# EAGLE design ACBoard (EAGLE 5.10)
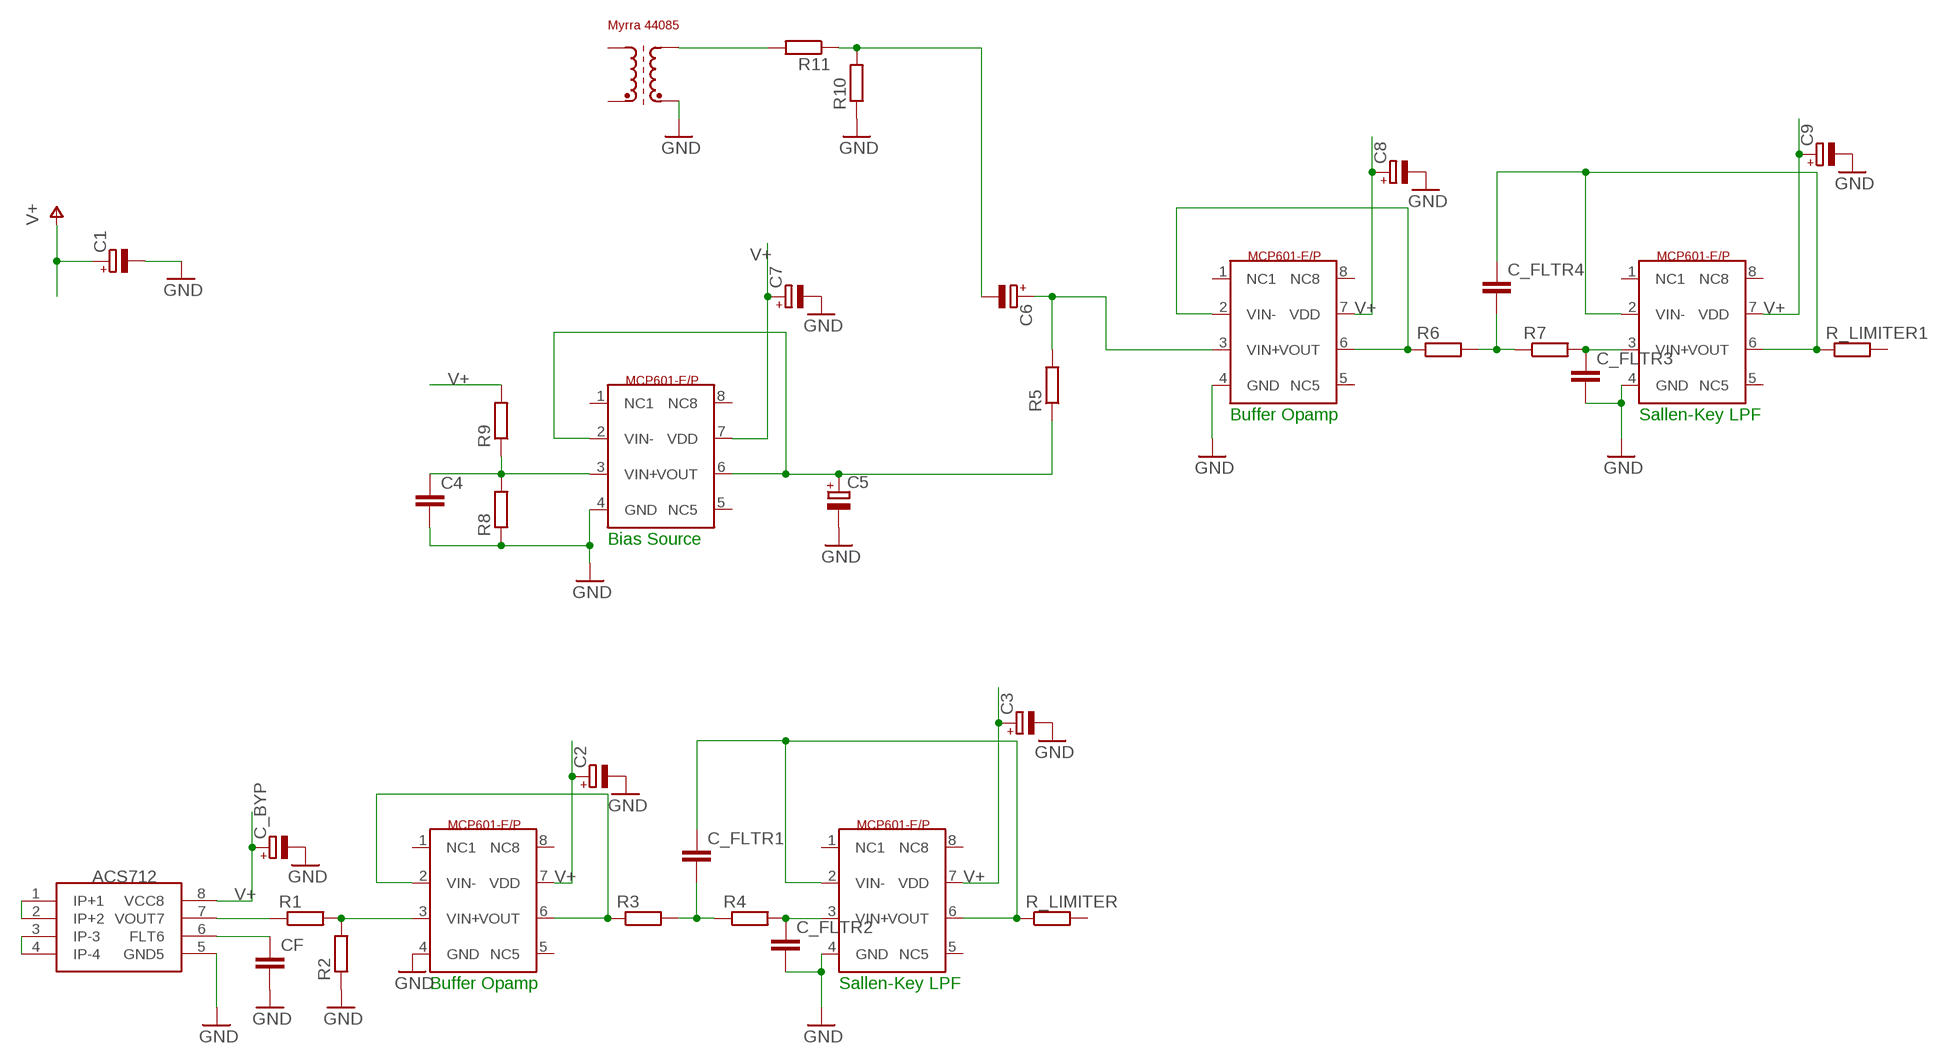
[diagram p0: schematic, sheet 1]

## Parts
BIAS  MCP601  [PDIP8]
C1  CPOL1  [E2,5-7---100UF]
C2  CPOL1  [E2,5-7---100UF]
C3  CPOL1  [E2,5-7---100UF]
C4  C5P  [C050-030-075]
C5  CPOL1  [E2,5-7---100UF]
C6  CPOL1  [E2,5-7---100UF]
C7  CPOL1  [E2,5-7---100UF]
C8  CPOL1  [E2,5-7---100UF]
C9  CPOL1  [E2,5-7---100UF]
C_BYP  CPOL1  [E2,5-7---100UF]
C_FLTR1  C5P  [C050-030-075]
C_FLTR2  C5P  [C050-030-075]
C_FLTR3  C5P  [C050-030-075]
C_FLTR4  C5P  [C050-030-075]
CF  C5P  [C050-030-075]
R1  R  [0207/10]
R2  R  [0207/10]
R3  R  [0207/10]
R4  R  [0207/10]
R5  R  [0207/10]
R6  R  [0207/10]
R7  R  [0207/10]
R8  R  [0207/10]
R9  R  [0207/10]
R10  R  [0207/10]
R11  R  [0207/10]
R_LIMITER  R  [0207/10]
R_LIMITER1  R  [0207/10]
U$1  ACS712  [SOIC8]
U$2  MCP601  [PDIP8]
U$3  MCP601  [PDIP8]
U$4  MCP601  [PDIP8]
U$5  MYRRA_4408  [4408]
VOLTAGE_FOLLOWER  MCP601  [PDIP8]

## Nets
GND: BIAS.4(GND) C1.- C2.- C3.- C4.2 C5.- C7.- C8.- C9.- C_BYP.- C_FLTR2.2 C_FLTR3.2 CF.2 R2.1 R8.1 R10.1 U$1.5(GND5) U$2.4(GND) U$3.4(GND) U$4.4(GND) U$5.PIN9(E2) VOLTAGE_FOLLOWER.4(GND)
N$1: CF.1 U$1.6(FLT6)
N$2: U$1.1(IP+1) U$1.2(IP+2)
N$3: U$1.3(IP-3) U$1.4(IP-4)
N$4: R3.1 VOLTAGE_FOLLOWER.2(VIN-) VOLTAGE_FOLLOWER.6(VOUT)
N$5: R1.1 U$1.7(VOUT7)
N$6: R1.2 R2.2 VOLTAGE_FOLLOWER.3(VIN+)
N$7: C_FLTR1.1 R_LIMITER.1 U$3.2(VIN-) U$3.6(VOUT)
N$8: C_FLTR1.2 R3.2 R4.1
N$9: C_FLTR2.1 R4.2 U$3.3(VIN+)
N$10: BIAS.3(VIN+) C4.1 R8.2 R9.1
N$11: BIAS.2(VIN-) BIAS.6(VOUT) C5.+ R5.1
N$12: C6.+ R5.2 U$2.3(VIN+)
N$13: R6.1 U$2.2(VIN-) U$2.6(VOUT)
N$14: C_FLTR4.1 R_LIMITER1.1 U$4.2(VIN-) U$4.6(VOUT)
N$15: C_FLTR4.2 R6.2 R7.1
N$16: C_FLTR3.1 R7.2 U$4.3(VIN+)
N$17: C6.- R10.2 R11.1
N$18: R11.2 U$5.PIN7(A2)
V+: BIAS.7(VDD) C1.+ C2.+ C3.+ C7.+ C8.+ C9.+ C_BYP.+ R9.2 U$1.8(VCC8) U$2.7(VDD) U$3.7(VDD) U$4.7(VDD) VOLTAGE_FOLLOWER.7(VDD)
Unconnected: BIAS.1(NC1) BIAS.5(NC5) BIAS.8(NC8) R_LIMITER1.2 R_LIMITER.2 U$2.1(NC1) U$2.5(NC5) U$2.8(NC8) U$3.1(NC1) U$3.5(NC5) U$3.8(NC8) U$4.1(NC1) U$4.5(NC5) U$4.8(NC8) U$5.PIN1(E1) U$5.PIN5(A1) VOLTAGE_FOLLOWER.1(NC1) VOLTAGE_FOLLOWER.5(NC5) VOLTAGE_FOLLOWER.8(NC8)

## Notes on the sheet
- Buffer Opamp | Sallen-Key LPF
- Bias Source
- Buffer Opamp | Sallen-Key LPF

## Library data of the parts
BIAS U$2-U$4 VOLTAGE_FOLLOWER = Pauls_parts:MCP601
C1-C3 C5-C9 C_BYP = ee2parts:CPOL: Electrolytic (polarised) capacitor
C4 C_FLTR1-C_FLTR4 CF = ee2parts:C: Capacitor
R1-R11 R_LIMITER R_LIMITER1 = ee2parts:R: Resistor
U$1 = Pauls_parts:ACS712
U$5 = Pauls_parts:MYRRA_4408

## Board
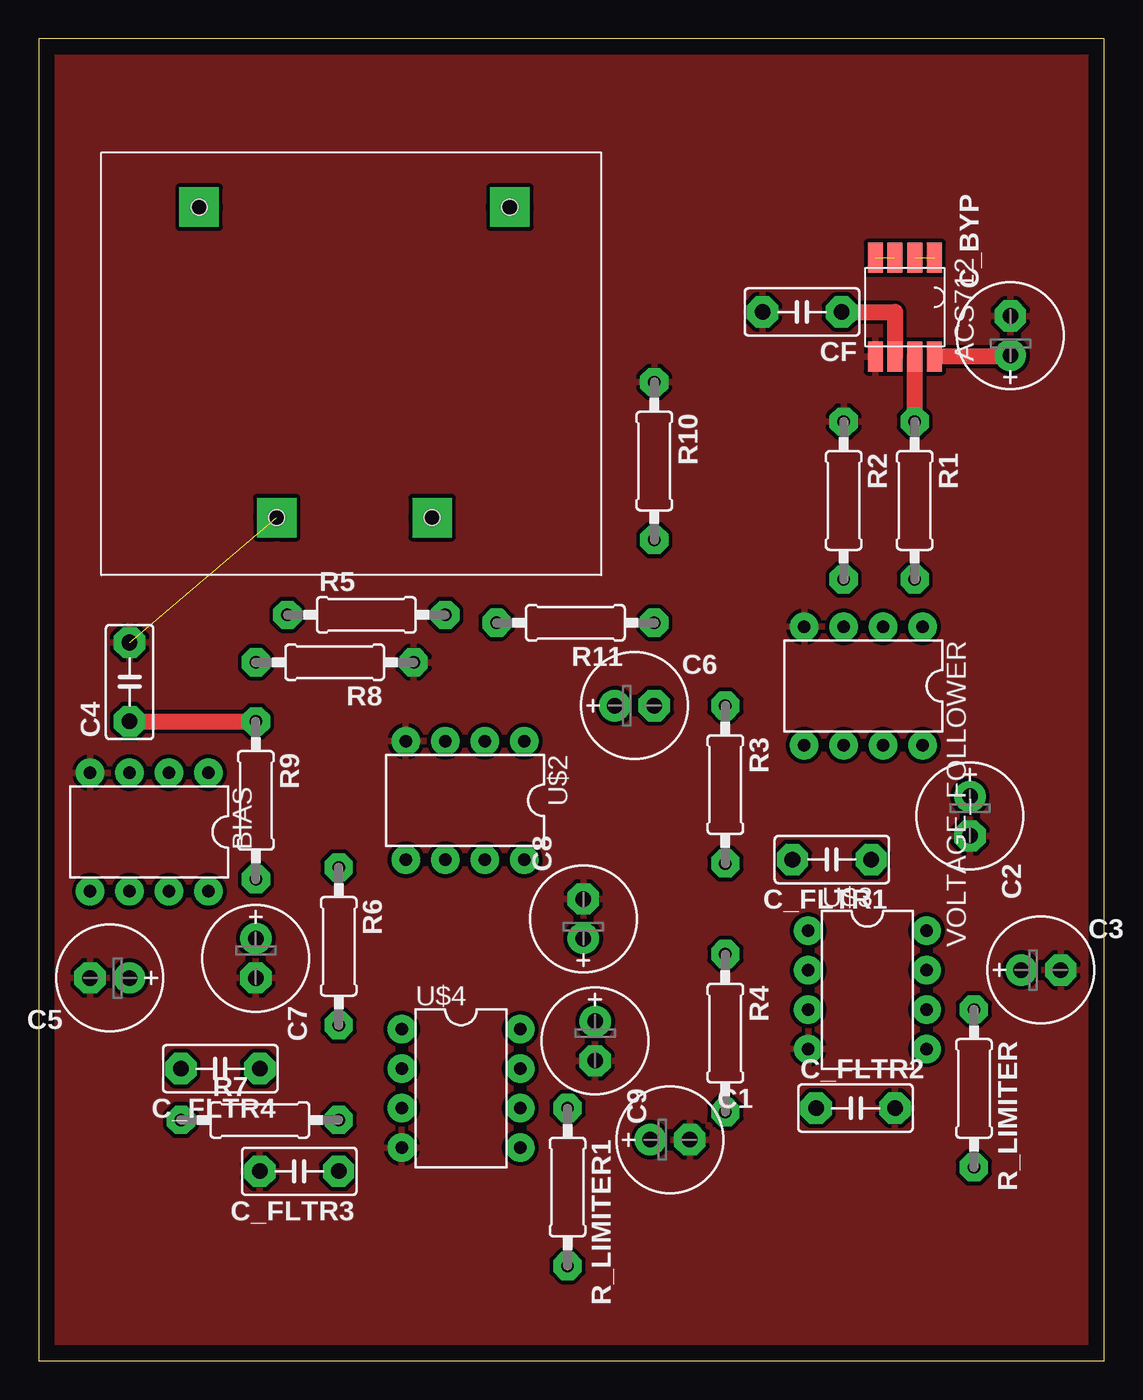
[diagram p1: board, top side]
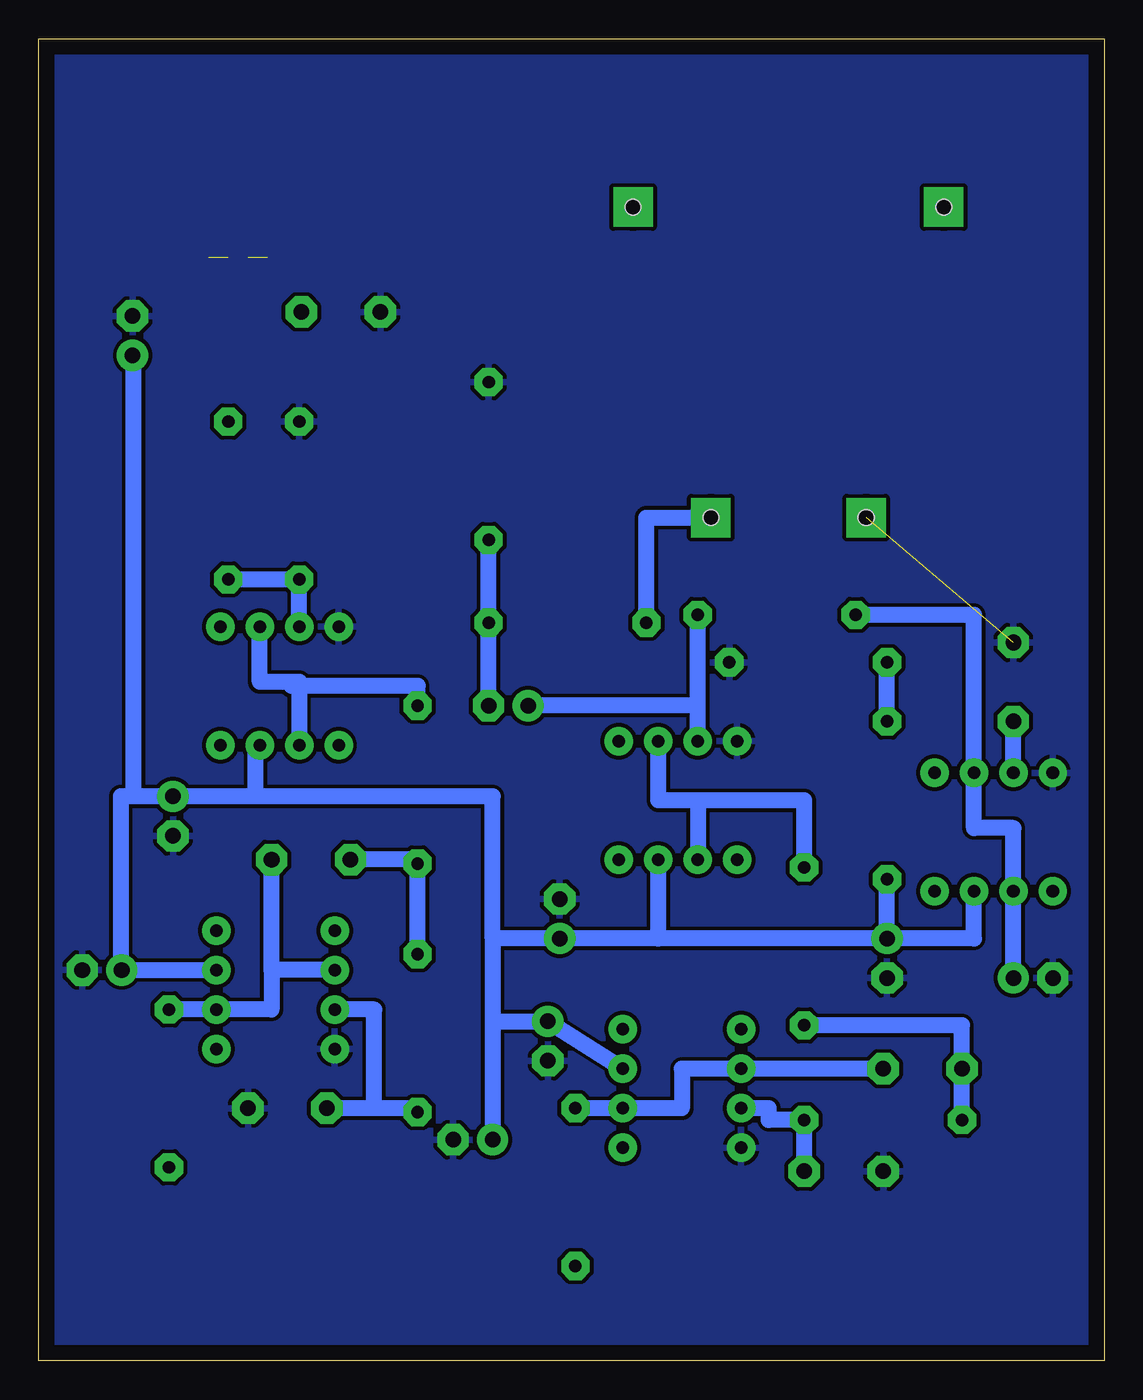
[diagram p2: board, bottom side, seen from below]

Size 68.58 x 85.09 mm. Coordinates in mm from the lower left corner, seen from the top.
Outline: 0,0 68.58,0 68.58,85.09 0,85.09 0,0
Copper layers (1*16): Top 0.035mm / dielectric 1.5mm / Bottom 0.035mm
Design rules "default *": minimum track width 10mil, minimum drill 24mil, track to track 10mil, track to pad 10mil, pad to pad 10mil, via to via 10mil, smd to smd 8mil, copper to edge 40mil, drill to drill 12mil, minimum pad ring 20mil, minimum via ring 15mil, stop-mask expansion 4mil, vias tented up to drill 0mil, thermal gap 10mil

### Footprints (pad centres in the part's own frame; a part is rotated, then mirrored left to right if it is on the bottom)
PDIP8 = drill 0.813 pad 1.27 round: 1 -3.81,-3.81; 2 -1.27,-3.81; 3 1.27,-3.81; 4 3.81,-3.81; 5 3.81,3.81; 6 1.27,3.81; 7 -1.27,3.81; 8 -3.81,3.81
E2,5-7---100UF = drill 1 pad 1.6 round: + -1.27,0 | drill 1 pad 1.6 octagon: - 1.27,0
C050-030-075 = drill 1 octagon: 1 -2.54,0; 2 2.54,0
0207/10 = drill 0.8 octagon: 1 -5.08,0; 2 5.08,0
SOIC8 = smd 1.93 x 0.965: 1 -4.445,1.27; 2 -4.445,0; 3 -4.445,-1.27; 4 -4.445,-2.54; 5 1.905,-2.54; 6 1.905,-1.27; 7 1.905,0; 8 1.905,1.27
4408 = drill 1.1 pad 2.54 square: PIN1 -10,10; PIN5 10,10; PIN7 5,-10; PIN9 -5,-10 | hole 1: -10,10; 10,10; -5,-10; 5,-10

### Placement (x,y rotation side)
BIAS  7.11,34.04 180 top
C1  40.64,14.22 0 top
C2  59.94,35.05 270 top
C3  64.52,25.15 0 top
C4  5.84,43.69 90 top
C5  4.57,24.64 180 top
C6  38.35,42.16 0 top
C7  13.97,25.91 270 top
C8  35.05,28.45 90 top
C9  35.81,20.57 270 top
C_BYP  62.55,65.98 90 top
C_FLTR1  51.05,32.26 180 top
C_FLTR2  52.58,16.26 0 top
C_FLTR3  16.76,12.19 180 top
C_FLTR4  11.68,18.8 180 top
CF  49.13,67.51 180 top
R1  56.39,55.37 270 top
R2  51.82,55.37 270 top
R3  44.2,37.08 270 top
R4  44.2,21.08 270 top
R5  21.08,48.01 0 top
R6  19.3,26.67 270 top
R7  14.22,15.49 0 top
R8  19.05,44.96 180 top
R9  13.97,36.07 270 top
R10  39.62,57.91 270 top
R11  34.54,47.5 180 top
R_LIMITER  60.2,17.53 270 top
R_LIMITER1  34.04,11.18 270 top
U$1  56.39,66.55 270 top
U$2  27.43,36.07 180 top
U$3  53.34,23.88 270 top
U$4  27.18,17.53 270 top
U$5  20.32,64.26 0 top
VOLTAGE_FOLLOWER  53.09,43.43 180 top

### Tracks (layer width: path | path; a pad name or v marks a point on that pad's centre or on a via)
GND  (1 unrouted)
  pour Bottom: 0,85.09 68.58,85.09 68.58,0 0,0
  pour Top: 0,85.09 68.58,85.09 68.58,0 0,0
N$1
  Top 1.016: CF.1 55.12,67.51 U$1.6
N$2  (1 unrouted)
N$3  (1 unrouted)
N$4
  Bottom 1.016: VOLTAGE_FOLLOWER.2 54.36,43.69 52.32,43.69 | 52.32,43.69 51.82,43.69 51.82,43.43 | 51.82,43.43 VOLTAGE_FOLLOWER.6 | 52.32,43.69 52.32,43.43 | R3.1 44.2,43.43 51.82,43.43
N$5
  Top 1.016: R1.1 U$1.7
N$6
  Bottom 1.016: R1.2 R2.2 VOLTAGE_FOLLOWER.3
N$7
  Bottom 1.016: U$3.2 53.59,25.15 | 53.59,25.15 53.59,22.61 U$3.6 R_LIMITER.1 | 53.59,25.15 C_FLTR1.1
N$8
  Bottom 1.016: R4.1 R3.2 44.2,32.26 C_FLTR1.2
N$9
  Bottom 1.016: U$3.3 46.99,22.61 46.99,16.26 | 46.99,16.26 44.2,16.26 R4.2 | 46.99,16.26 C_FLTR2.1
N$10
  Top 1.016: C4.1 R9.1
  Bottom 1.016: BIAS.3 C4.1 | R9.1 R8.2
N$11
  Bottom 1.016: R5.1 8.38,48.01 BIAS.2 8.38,34.29 5.84,34.29 BIAS.6 C5.+
N$12
  Bottom 1.016: 26.16,42.16 C6.+ | U$2.3 26.16,42.16 | 26.16,42.16 R5.2
N$13
  Bottom 1.016: 26.16,36.07 U$2.6 | 26.16,36.07 28.7,36.07 U$2.2 | R6.1 19.3,36.07 26.16,36.07
N$14
  Bottom 1.016: C_FLTR4.1 U$4.2 27.18,18.8 27.18,16.26 U$4.6 R_LIMITER1.1
N$15
  Bottom 1.016: R6.2 9.14,21.59 C_FLTR4.2 R7.1
N$16
  Bottom 1.016: U$4.3 21.59,16.26 21.59,15.49 R7.2 C_FLTR3.1
N$17
  Bottom 1.016: C6.- R11.1 R10.2
N$18
  Bottom 1.016: U$5.PIN7 29.46,54.26 R11.2
V+
  Top 1.016: U$1.8 62.55,64.64 C_BYP.+
  Bottom 1.016: 39.37,27.18 39.37,21.84 | 39.37,27.18 39.37,36.32 54.61,36.32 | 54.61,36.32 C2.+ 62.48,36.32 | 62.48,36.32 63.31,36.32 63.31,25.15 C3.+ U$3.7 | VOLTAGE_FOLLOWER.7 54.61,39.62 54.61,36.32 | 39.37,27.18 C8.+ 28.7,27.18 | C7.+ 28.7,27.18 | BIAS.7 8.38,27.18 C7.+ | 28.7,27.18 U$2.7 | C7.+ R9.2 | U$4.7 C9.+ 39.37,21.84 | 39.37,21.84 C1.+ | C_BYP.+ 62.48,64.71 62.48,36.32